# EAGLE schematic untitled (EAGLE 9.6.2)
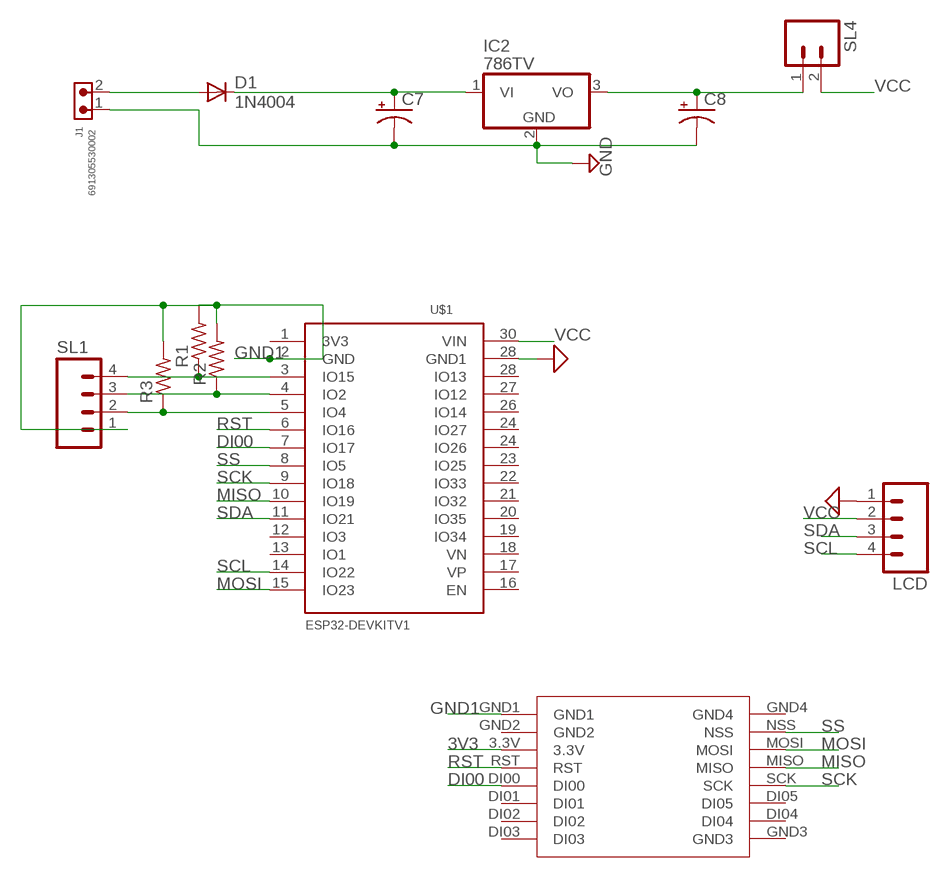
[diagram p0: schematic, sheet 1]

## Parts
C7  CAPACITOR-PE5-10.5  [E5-10,5]
C8  CAPACITOR-PE5-6  [E5-6]
D1  1N4004  [DO41-10]
IC2  786TV  [TO220V]
J1  691305530002  691305530002  [691305530002]
LCD  M04  [04P]
R1  R-US_0207/10  [0207/10]
R2  R-US_0207/10  [0207/10]
R3  R-US_0207/10  [0207/10]
SL1  M04  [04P]
SL4  M02  [02P]
U$1  ESP32DEVKITV1  [ESP32-DEVKITV1]
U$2  LORASX1278  [LORASX1278]

## Nets
3V3: U$2.3.3V
DI00: U$1.7(IO17) U$2.DI00
GND: C7.- C8.- IC2.2(GND) J1.1 LCD.1 U$1.28(GND1) ; supply symbol labelled SUP
GND1: R1.2 R2.2 R3.2 SL1.1 U$1.2(GND) U$2.GND1
MISO: U$1.10(IO19) U$2.MISO
MOSI: U$1.15(IO23) U$2.MOSI
N$1: D1.A J1.2
N$2: C8.+ IC2.3(VO) SL4.1
N$3: R1.1 SL1.4 U$1.3(IO15)
N$4: R2.1 SL1.3 U$1.4(IO2)
N$7: R3.1 SL1.2 U$1.5(IO4)
RST: U$1.6(IO16) U$2.RST
SCK: U$1.9(IO18) U$2.SCK
SCL: LCD.4 U$1.14(IO22)
SDA: LCD.3 U$1.11(IO21)
SS: U$1.8(IO5) U$2.NSS
VCC: LCD.2 SL4.2 U$1.30(VIN)
VIN: C7.+ D1.C IC2.1(VI)
Unconnected: U$1.1(3V3) U$1.12(IO3) U$1.13(IO1) U$1.16(EN) U$1.17(VP) U$1.18(VN) U$1.19(IO34) U$1.20(IO35) U$1.21(IO32) U$1.22(IO33) U$1.23(IO25) U$1.24(IO26) U$1.24(IO27) U$1.26(IO14) U$1.27(IO12) U$1.28(IO13) U$2.DI01 U$2.DI02 U$2.DI03 U$2.DI04 U$2.DI05 U$2.GND2 U$2.GND3 U$2.GND4

## Library data of the parts
C7 C8 = BeagleBone_Blue_R3:CAPACITOR-P: POLARIZED CAPACITOR, American symbol
D1 = adafruit:1N4004: DIODE General purpose 1N400x type rectifier (With bigger pads) http://www.ladyada.net/library/pcb/eaglelibrary.html
IC2 = linear:78*: Positive VOLTAGE REGULATOR Source: http://cache.national.com/ds/LM/LM78L05.pdf http://www.fairchildsemi.com/ds/LM/LM7805.pdf
J1 = Wurth_Connectors_WR-TBL Pluggable Connector:691305530002: WR-TBL Serie 3055 - 5,08 mm - PCB Header Vertical Entry with Plastic Latches KIND PROPERTIES Pitch 5.08 mm MATERIAL PROPERTIES Insulator Material PA66 Insulator Flammability Rating UL94 V-0 Insulator Color Green Terminal Material Copper Alloy Terminal Plating Tin-plated surface GENERAL INFORMATION Operating Temperature -40 up to +105 °C ELECTRICAL PROPERTIES IR UL 16 A Working Voltage [UL] 300 V (AC) Withstanding Voltage [UL] 2500 V (AC) Contact Resistance [UL] 20 mΩ CERTIFICATION UL Approval E315414 <https://www.we-online.com/catalog/media/o135349v209%20Family_WR-TBL3_6913055300xx.jpg> Details see: https://www.we-online.com/catalog/en/TBL_5_08_3055_6913055300XX/ Updated by Ella Wu 2019-12-30 2019(C) Wurth Elektronik; DATASHEET-URL: https://www.we-online.com/catalog/datasheet/691305530002.pdf; IR-UL: 16A; MOUNT: THT; PART-NUMBER: 691305530002; PINS: 2; PITCH: 5.08mm; TYPE: Vertical; WORKING-VOLTAGE-UL: 300V (AC)
LCD SL1 = con-amp-quick:M04: AMP QUICK CONNECTOR; OC_FARNELL: unknown; OC_NEWARK: unknown
R1-R3 = adafruit:R-US_: RESISTOR, American symbol
SL4 = con-amp-quick:M02: AMP QUICK CONNECTOR; OC_FARNELL: unknown; OC_NEWARK: unknown
U$1 = ESP32-DEVKITV1:ESP32DEVKITV1
U$2 = sx1278:LORASX1278